# Altium schematic sheet NB3000_Uart_Serial_Port.SchDoc
size A
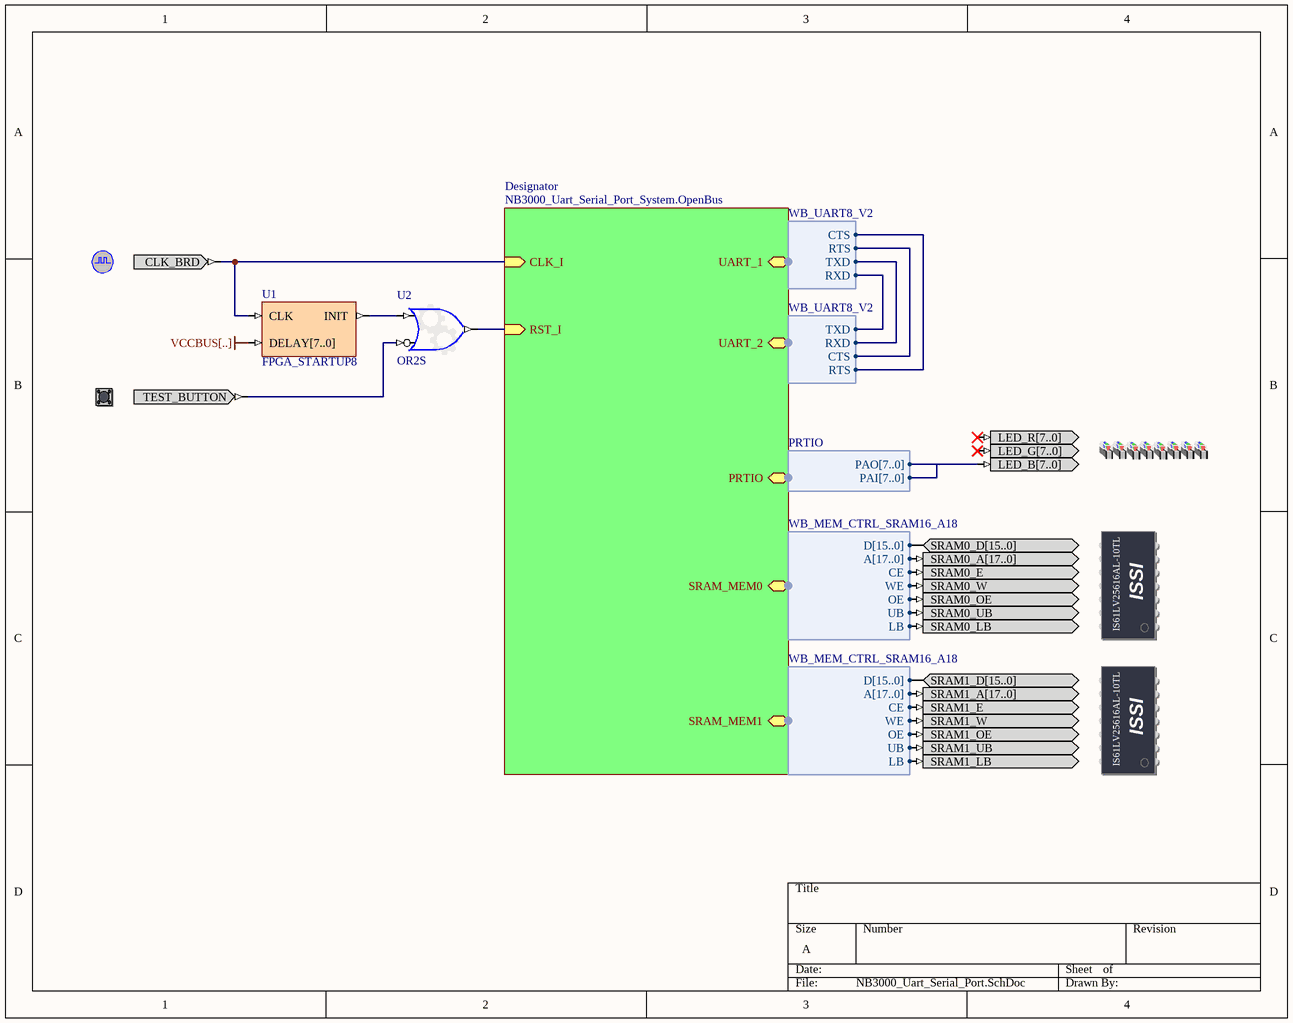
[diagram p0: NB3000_Uart_Serial_Port.SchDoc]

## Parts
(Parts that share a designator on the sheet are numbered #1, #2 ... from top to bottom, then left to right.)
?#1  CLOCK_BOARD  (value not drawn)
?#2  TEST_BUTTON  (value not drawn)
?#3  LEDS_RGB  (value not drawn)
?#4  SRAM0  (value not drawn)
?#5  SRAM1  (value not drawn)
U1  FPGA_STARTUP8
U2  OR2S

## Sub-sheets
Designator = NB3000_Uart_Serial_Port_System.OpenBus: SRAM_MEM1 (harness WB_MEM_CTRL_SRAM16_A18), UART_1 (harness WB_UART8_V2), UART_2 (harness WB_UART8_V2), PRTIO (harness PRTIO), RST_I (in), CLK_I (in), SRAM_MEM0 (harness WB_MEM_CTRL_SRAM16_A18)

## Harnesses
WB_MEM_CTRL_SRAM16_A18: D[15..0], A[17..0], CE, WE, OE, UB, LB
PRTIO: PAO[7..0], PAI[7..0]
WB_UART8_V2: TXD, RXD, CTS, RTS

## Nets
VCCBUS[..]: U1.DELAY[7..0]
Net?#1_CLK_BRD: ?#1.CLK_BRD U1.CLK ; sheet Designator/CLK_I
Net?#2_TEST_BUTTON: ?#2.TEST_BUTTON U2.I1
Net?#3_LED_B[7..0]: ?#3.LED_B[7..0] ; sheet Designator/PRTIO.PAO[7..0], sheet Designator/PRTIO.PAI[7..0]
Net?#4_SRAM0_A[17..0]: ?#4.SRAM0_A[17..0] ; sheet Designator/SRAM_MEM0.A[17..0]
Net?#4_SRAM0_D[15..0]: ?#4.SRAM0_D[15..0] ; sheet Designator/SRAM_MEM0.D[15..0]
Net?#4_SRAM0_E: ?#4.SRAM0_E ; sheet Designator/SRAM_MEM0.CE
Net?#4_SRAM0_LB: ?#4.SRAM0_LB ; sheet Designator/SRAM_MEM0.LB
Net?#4_SRAM0_OE: ?#4.SRAM0_OE ; sheet Designator/SRAM_MEM0.OE
Net?#4_SRAM0_UB: ?#4.SRAM0_UB ; sheet Designator/SRAM_MEM0.UB
Net?#4_SRAM0_W: ?#4.SRAM0_W ; sheet Designator/SRAM_MEM0.WE
Net?#5_SRAM1_A[17..0]: ?#5.SRAM1_A[17..0] ; sheet Designator/SRAM_MEM1.A[17..0]
Net?#5_SRAM1_D[15..0]: ?#5.SRAM1_D[15..0] ; sheet Designator/SRAM_MEM1.D[15..0]
Net?#5_SRAM1_E: ?#5.SRAM1_E ; sheet Designator/SRAM_MEM1.CE
Net?#5_SRAM1_LB: ?#5.SRAM1_LB ; sheet Designator/SRAM_MEM1.LB
Net?#5_SRAM1_OE: ?#5.SRAM1_OE ; sheet Designator/SRAM_MEM1.OE
Net?#5_SRAM1_UB: ?#5.SRAM1_UB ; sheet Designator/SRAM_MEM1.UB
Net?#5_SRAM1_W: ?#5.SRAM1_W ; sheet Designator/SRAM_MEM1.WE
NetU1_INIT: U1.INIT U2.I0
NetU2_O: U2.O ; sheet Designator/RST_I
(unnamed): sheet Designator/UART_2.TXD, sheet Designator/UART_1.RXD
(unnamed): sheet Designator/UART_2.RXD, sheet Designator/UART_1.TXD
(unnamed): sheet Designator/UART_2.CTS, sheet Designator/UART_1.RTS
(unnamed): sheet Designator/UART_2.RTS, sheet Designator/UART_1.CTS

Not connected (* = marked no-connect by the designer): ?#3 LED_G[7..0]* LED_R[7..0]*

## Notes on the sheet
- (in symbol SRAM0) ISSI; IS61LV25616AL-10TL
- (in symbol SRAM1) ISSI; IS61LV25616AL-10TL

## Library data of the parts
?#1 = CLOCK_BOARD: Global System Clock Supply; PortComponent: True; Published: 19-Nov-2003; Publisher: Altium Limited; HelpURL: TR0143 Technical Reference Manual for Altium's Desktop NanoBoard NB2DSK01.pdf#page=41; UseInDSF: True
?#2 = TEST_BUTTON: Test / Reset Button; PortComponent: True; Published: 19-Nov-2003; Publisher: Altium Limited; HelpURL: TR0143 Technical Reference Manual for Altium's Desktop NanoBoard NB2DSK01.pdf#page=53
?#3 = LEDS_RGB: LEDS RGB; PortComponent: True; Published: 11-Mar-2009; Publisher: Altium Limited; HelpURL: https://wiki.altium.com/display/ADOH/NanoBoard+3000+-+RGB+User+LEDs
?#4 = SRAM0: Free Static RAM - Daughterboard; PortComponent: True; Published: 14-May-2007; Publisher: Altium Limited; HelpURL: https://wiki.altium.com/display/ADOH/NanoBoard+3000+-+Independent+SRAM
?#5 = SRAM1: Free Static RAM - Daughterboard; PortComponent: True; Published: 14-May-2007; Publisher: Altium Limited; HelpURL: https://wiki.altium.com/display/ADOH/NanoBoard+3000+-+Independent+SRAM
U1 = FPGA_STARTUP8: FPGA Startup With 8 Bit Delay; Published: 9-Dec-2004; Publisher: Altium Limited; HelpURL: CR0119 FPGA_STARTUPx Powerup Delay Unit.pdf; LastRevisionNo: 1.00.00; ComponentLink1Description: Core &Resource Usage; ComponentLink1URL: CR0139 FPGA Peripheral Resource Usage.pdf#page=11
U2 = GATE: Configurable Generic Gate; ConfiguratorName: GENERIC_GATE; ConfigurationParameters: {}Version[1.0]{}GateKind[OR]{}BusInput[False]{}GateInputType[Bit]{}GateOutputOption[Normal]{}BusWidth[8]{}RegisterOutputs[False]{}NegativeClockEdge[False]{}InputCount[2]{}InputInvert0[False]{}InputInvert1[True]{}; LastRevisionNo: 1.00.00; Published: 3-Sep-2008; Publisher: Altium Limited